# EAGLE design Servo_LED (EAGLE 9.5.2)
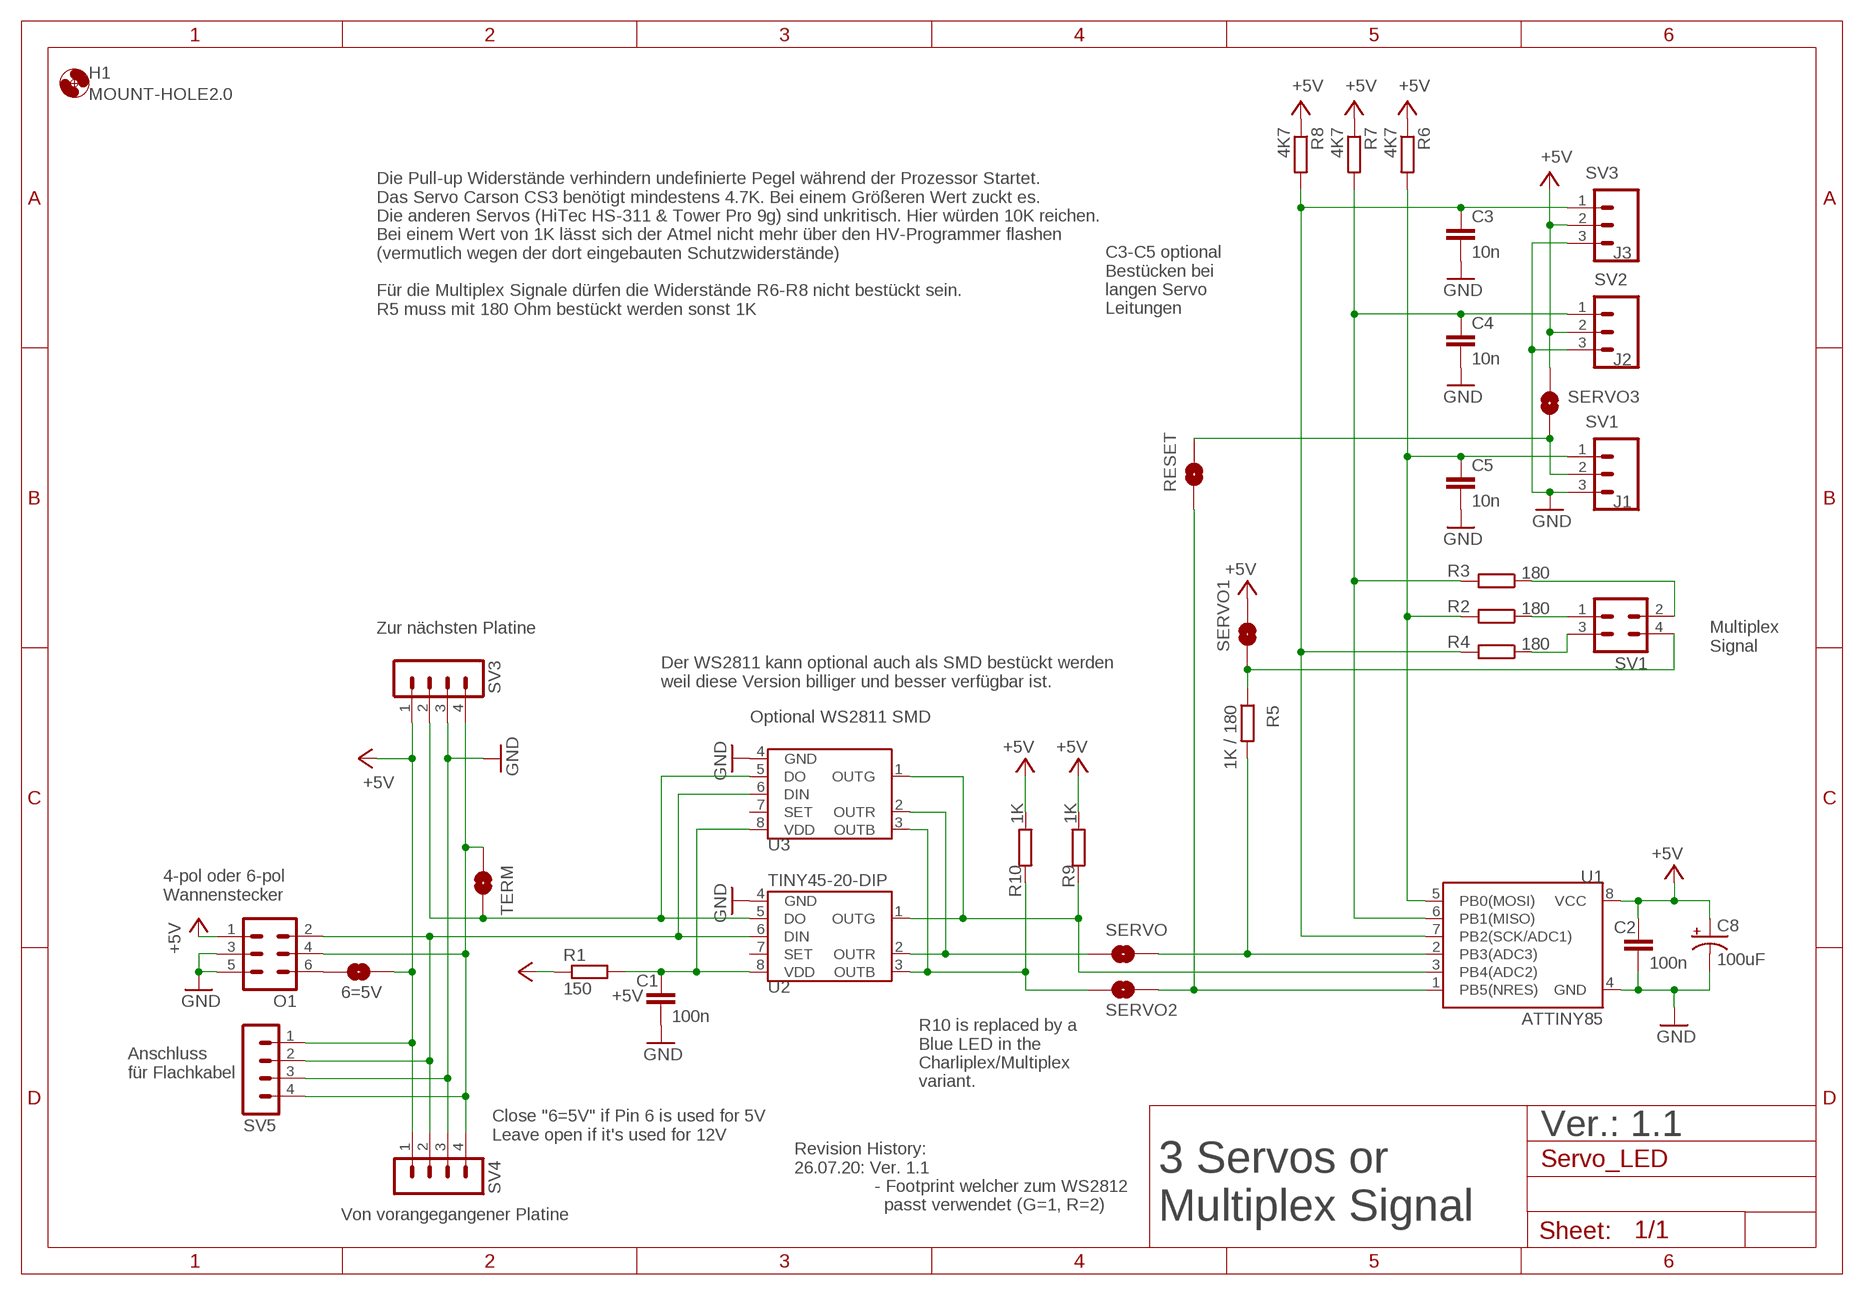
[diagram p0: schematic, sheet 1]

## Parts
6=5V  SOLDERJUMPERNO  [SJ_2S-NO]
C1  100n  C-EU025-024X044  [C025-024X044]
C2  100n  C-EU025-024X044  [C025-024X044]
C3  10n  C-EUC0805  [C0805]
C4  10n  C-EUC0805  [C0805]
C5  10n  C-EUC0805  [C0805]
C8  100uF  SPARKFUN-CAPACITORS_100UF-25V-20%(PTH)  [SPARKFUN-CAPACITORS_CPOL-RADIAL-100UF-25V]
H1  MOUNT-HOLE2.0  [2,0]
J1  SV1  M03PTH  [1X03]
J2  SV2  M03PTH  [1X03]
J3  SV3  M03PTH  [1X03]
O1  ML6  [ML6]
R1  150  RCL_R-EU_0207/2V  [RCL_0207/2V]
R2  180  RCL_R-EU_0207/2V  [RCL_0207/2V]
R3  180  RCL_R-EU_0207/2V  [RCL_0207/2V]
R4  180  RCL_R-EU_0207/2V  [RCL_0207/2V]
R5  1K / 180  RCL_R-EU_0207/2V  [RCL_0207/2V]
R6  4K7  RCL_R-EU_0207/2V  [RCL_0207/2V]
R7  4K7  RCL_R-EU_0207/2V  [RCL_0207/2V]
R8  4K7  RCL_R-EU_0207/2V  [RCL_0207/2V]
R9  1K  RCL_R-EU_0207/2V  [RCL_0207/2V]
R10  1K  RCL_R-EU_0207/2V  [RCL_0207/2V]
RESET  SOLDERJUMPERNO  [SJ_2S-NO]
SERVO  SOLDERJUMPERNO  [SJ_2S-NO]
SERVO1  SOLDERJUMPERNO  [SJ_2S-NO]
SERVO2  SOLDERJUMPERNO  [SJ_2S-NO]
SERVO3  SOLDERJUMPERNO  [SJ_2S-NO]
SV1  MA02-2MUX-SIGNAL  [MUX-SIGNAL]
SV3  MA04-1  [MA04-1]
SV4  MA04-1  [MA04-1]
SV5  MA04-1  [MA04-1]
TERM  SOLDERJUMPERNO  [SJ_2S-NO]
U1  ATTINY85  ATTINY45TINY85-20-DIP  [DIP08]
U2  TINY45-20-DIP  S3PO_MODUL_WS2811_SOUND_MP3-TF-16P_WS2811_AND_ATTINY_WS2811-ICTINY45-20-DIP  [S3PO_MODUL_WS2811_SOUND_MP3-TF-16P_WS2811_AND_ATTINY_WS2811_DIP08]
U3  WS2811 SOT-8  S3PO_MODUL_WS2811_SOUND_MP3-TF-16P_WS2811_AND_ATTINY_WS2811-ICSOP8  [SOP8]

## Nets
+5V: 6=5V.2 C2.1 C8.1(+) J2.2 J3.2 O1.1 R1.1 R6.1 R7.1 R8.1 R9.1 R10.1 SERVO1.2 SERVO3.2 SV3.1 SV4.1 SV5.1 U1.8(VCC)
GND: C1.2 C2.2 C3.2 C4.2 C5.2 C8.2(-) J1.3 J2.3 J3.3 O1.3 O1.5 SV3.3 SV4.3 SV5.3 U1.4(GND) U2.4(GND) U3.4(GND)
N$1: O1.2 SV4.2 SV5.2 U2.6(DIN) U3.6(DIN)
N$2: SV3.2 TERM.2 U2.5(DO) U3.5(DO)
N$3: O1.4 SV3.4 SV4.4 SV5.4 TERM.1
N$4: C1.1 R1.2 U2.8(VDD) U3.8(VDD)
N$5: R2.1 SV1.1
N$6: 6=5V.1 O1.6
N$7: R9.2 U1.3(PB4(ADC2)) U2.1(OUTG) U3.1(OUTG)
N$8: R5.2 SERVO.2 U1.2(PB3(ADC3))
N$9: C4.1 J2.1 R3.2 R7.2 U1.6(PB1(MISO))
N$10: R4.1 SV1.3
N$11: R3.1 SV1.2
N$12: R5.1 SERVO1.1 SV1.4
N$13: SERVO.1 U2.2(OUTR) U3.2(OUTR)
N$14: C3.1 J3.1 R4.2 R8.2 U1.7(PB2(SCK/ADC1))
N$15: RESET.1 SERVO2.2 U1.1(PB5(NRES))
N$16: C5.1 J1.1 R2.2 R6.2 U1.5(PB0(MOSI))
N$17: J1.2 RESET.2 SERVO3.1
N$18: R10.2 SERVO2.1 U2.3(OUTB) U3.3(OUTB)
Unconnected: U2.7(SET) U3.7(SET)

## Notes on the sheet
- Die Pull-up Widerstände verhindern undefinierte Pegel während der Prozessor Startet. 
  Das Servo Carson CS3 benötigt mindestens 4.7K. Bei einem Größeren Wert zuckt es. 
  Die anderen Servos (HiTec HS-311 & Tower Pro 9g) sind unkritisch. Hier würden 10K reichen. 
  Bei einem Wert von 1K lässt sich der Atmel nicht mehr über den HV-Programmer flashen 
  (vermutlich wegen der dort eingebauten Schutzwiderstände) 
  
  Für die Multiplex Signale dürfen die Widerstände R6-R8 nicht bestückt sein.
  R5 muss mit 180 Ohm bestückt werden sonst 1K
- C3-C5 optional 
  Bestücken bei
  langen Servo 
  Leitungen
- Zur nächsten Platine
- Multiplex
  Signal
- Der WS2811 kann optional auch als SMD bestückt werden
  weil diese Version billiger und besser verfügbar ist.
- Optional WS2811 SMD
- 4-pol oder 6-pol 
  Wannenstecker
- Anschluss
  für Flachkabel
- R10 is replaced by a 
  Blue LED in the 
  Charliplex/Multiplex 
  variant.
- Ver.: 1.1
- Close "6=5V" if Pin 6 is used for 5V
  Leave open if it's used for 12V
- Von vorangegangener Platine
- 3 Servos or 
  Multiplex Signal
- Revision History:
  26.07.20: Ver. 1.1
                  - Footprint welcher zum WS2812 
                    passt verwendet (G=1, R=2)

## Library data of the parts
6=5V RESET SERVO SERVO1-SERVO3 TERM = SparkFun-Retired:SOLDERJUMPER: Solder Jumper Standard SMD solder jumper. Used to automate production. Two varients : Normally Open and Normally Closed are the same, but have different paste layers. NC will have a large amount of paste and should jumper during reflow.
C1-C5 = rcl:C-EU: CAPACITOR, European symbol; SPICEPREFIX: C
C8 = Sound_MP3-TF-16P_and_WS2811:SPARKFUN-CAPACITORS_100UF-25V-20%(PTH): CAP-08439; PROD_ID: CAP-08439
H1 = holes:MOUNT-HOLE: MOUNTING HOLE with drill center marker
J1-J3 = SparkFun-Connectors:M03: Header 3 Standard 3-pin 0.1" header. Use with straight break away headers (SKU : PRT-00116), right angle break away headers (PRT-00553), swiss pins (PRT-00743), machine pins (PRT-00117), and female headers (PRT-00115). Molex polarized connector foot print use with SKU : PRT-08232 with associated crimp pins and housings.
O1 = con-harting-ml:ML6: HARTING; OC_FARNELL: unknown; OC_NEWARK: unknown
R1-R10 = Sound_MP3-TF-16P_and_WS2811:RCL_R-EU_: RESISTOR, European symbol; SPICEPREFIX: R
SV1 = con-lstb:MA02-2: PIN HEADER
SV3-SV5 = con-lstb:MA04-1: PIN HEADER
U1 = SparkFun-DigitalIC:ATTINY45: Atmel 8-pin 2/4/8kB flash uC; PROD_ID: IC-09445; VALUE: TINY85-20-DIP
U2 = S3PO_Modul_WS2811:S3PO_MODUL_WS2811_SOUND_MP3-TF-16P_WS2811_AND_ATTINY_WS2811-IC: Die Pin Nummern für R und G sind getauscht damit sie gleich angesteuert werden wie die WS2812. Der Daten Strom der WS2811 ist RGB, Beim WS2812 ist es aber GRB.; PROD_ID: IC-09439
U3 = S3PO_Modul_WS2811:S3PO_MODUL_WS2811_SOUND_MP3-TF-16P_WS2811_AND_ATTINY_WS2811-IC: Die Pin Nummern für R und G sind getauscht damit sie gleich angesteuert werden wie die WS2812. Der Daten Strom der WS2811 ist RGB, Beim WS2812 ist es aber GRB.

## Board
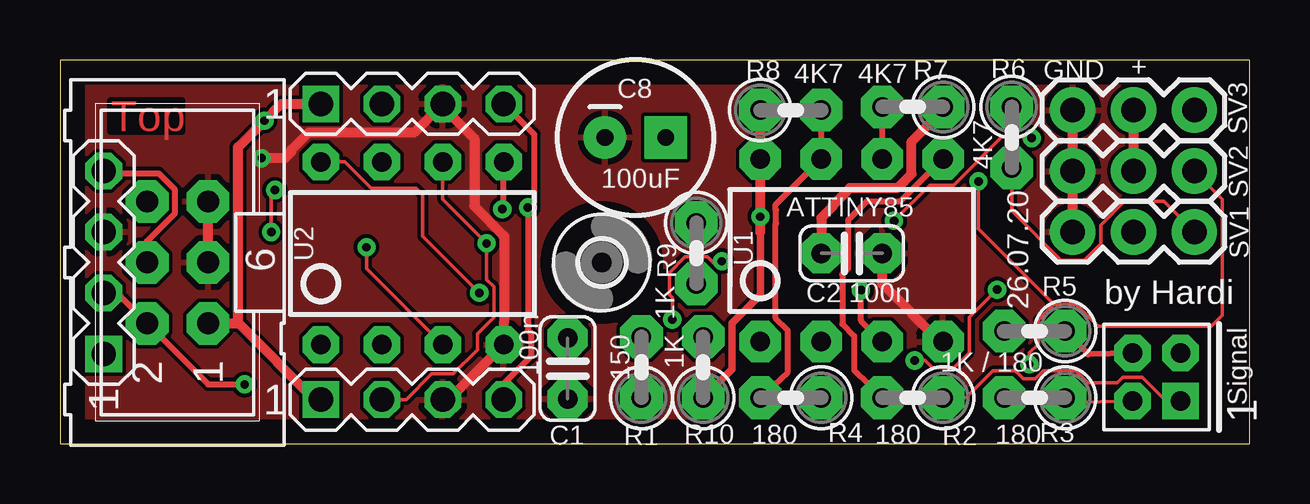
[diagram p1: board, top side]
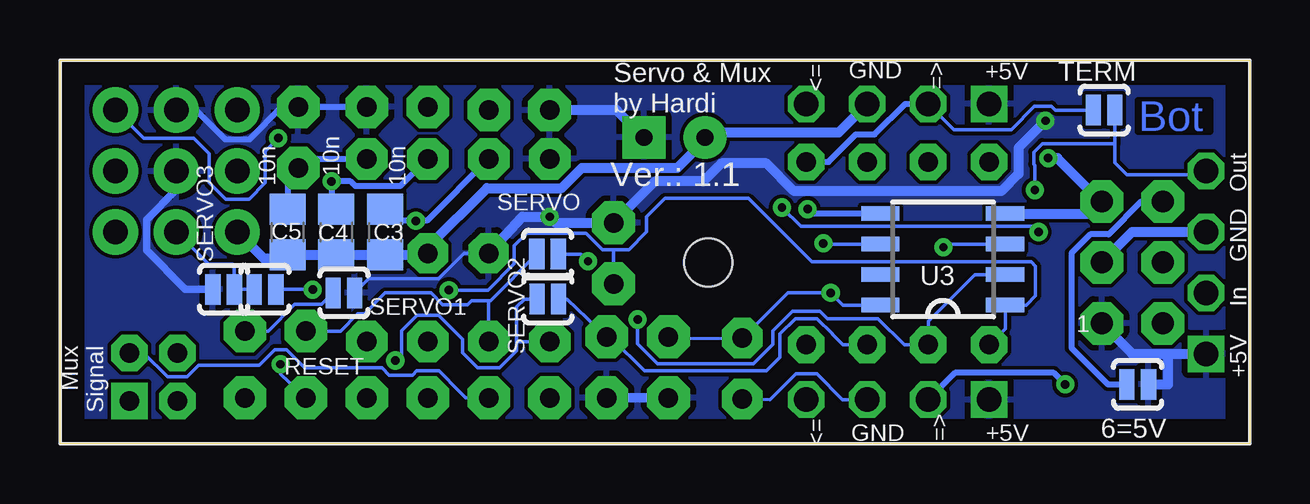
[diagram p2: board, bottom side, seen from below]

Size 49.6 x 15.99 mm. Coordinates in mm from the lower left corner, seen from the top.
Outline: 0,0 49.6,0 49.6,15.99 0,15.99 0,0
Copper layers (1*16): Top 0.035mm / dielectric 1.5mm / Bottom 0.035mm
Design rules "default": minimum track width 6mil, minimum drill 0.35mm, track to track 6mil, track to pad 6mil, pad to pad 6mil, via to via 6mil, smd to smd 6mil, copper to edge 40mil, drill to drill 6mil, minimum pad ring 10mil, minimum via ring 8mil, stop-mask expansion 4mil, vias tented up to drill 0mil, thermal gap 10mil

### Footprints (pad centres in the part's own frame; a part is rotated, then mirrored left to right if it is on the bottom)
SJ_2S-NO = smd 0.635 x 1.27: 1 -0.45,0; 2 0.45,0
C025-024X044 = drill 0.813 pad 1.676 octagon: 1 -1.27,0; 2 1.27,0
C0805 = smd 1.3 x 1.5: 1 -0.95,0; 2 0.95,0
SPARKFUN-CAPACITORS_CPOL-RADIAL-100UF-25V = drill 0.7 pad 1.778 square: 1 1.27,0 | drill 0.7 pad 1.778: 2 -1.27,0
2,0 = hole 2: 0,0
1X03 = drill 1.016 pad 1.88: 1 0,0; 2 2.54,0; 3 5.08,0
ML6 = drill 0.914 pad 1.778 octagon: 1 -2.54,-1.27; 2 -2.54,1.27; 3 0,-1.27; 4 0,1.27; 5 2.54,-1.27; 6 2.54,1.27
RCL_0207/2V = drill 0.813 pad 1.778 octagon: 1 -1.27,0; 2 1.27,0
MUX-SIGNAL = drill 0.8 pad 1.524 square: 1 -1,-1 | drill 0.8 pad 1.524 octagon: 2 -1,1; 3 1,-1; 4 1,1
MA04-1 = drill 1.016 pad 1.524 square: 1 -3.81,0 | drill 1.016 pad 1.524 octagon: 2 -1.27,0; 3 1.27,0; 4 3.81,0
DIP08 = drill 0.813 pad 1.727 octagon: 1 -3.81,-3.81; 2 -1.27,-3.81; 3 1.27,-3.81; 4 3.81,-3.81; 5 3.81,3.81; 6 1.27,3.81; 7 -1.27,3.81; 8 -3.81,3.81
S3PO_MODUL_WS2811_SOUND_MP3-TF-16P_WS2811_AND_ATTINY_WS2811_DIP08 = drill 0.813 pad 1.524 octagon: 1 -3.81,-3.81; 2 -1.27,-3.81; 3 1.27,-3.81; 4 3.81,-3.81; 5 3.81,3.81; 6 1.27,3.81; 7 -1.27,3.81; 8 -3.81,3.81
SOP8 = smd 0.6 x 1.6: 1 -1.905,-2.6; 2 -0.635,-2.6; 3 0.635,-2.6; 4 1.905,-2.6; 5 1.905,2.6; 6 0.635,2.6; 7 -0.635,2.6; 8 -1.905,2.6

### Placement (x,y rotation side)
6=5V  4.68,2.48 0 bottom
C1  21.16,3.14 270 top
C2  33,7.94 0 top
C3  36.05,8.83 270 bottom
C4  38.08,8.83 270 bottom
C5  40.11,8.83 270 bottom
C8  23.98,12.76 0 top
H1  22.59,7.55 0 top
J1  47.29,8.83 180 top
J2  47.29,11.37 180 top
J3  47.29,13.91 180 top
O1  4.9,7.55 90 top
R1  24.24,3.19 90 top
R2  35.54,1.92 180 top
R3  40.62,1.92 180 top
R4  30.46,1.92 180 top
R5  40.62,4.7 180 top
R6  39.67,12.76 270 top
R7  35.54,14.03 180 top
R8  30.46,13.91 0 top
R9  26.52,7.94 270 top
R10  26.81,3.19 90 top
RESET  41.05,6.44 180 bottom
SERVO  29.28,7.9 180 bottom
SERVO1  37.76,6.28 0 bottom
SERVO2  29.27,6.03 180 bottom
SERVO3  42.78,6.44 180 bottom
SV1  45.71,2.78 90 top
SV3  14.68,14.16 0 top
SV4  14.68,1.84 0 top
SV5  1.82,7.55 90 top
TERM  6.08,13.91 180 bottom
U1  33,8.06 0 top
U2  14.68,7.94 0 top
U3  12.8,7.68 90 bottom

### Tracks (layer width: path | path; a pad name or v marks a point on that pad's centre or on a via)
+5V  (via drill 0.35)
  Top 0.305: R10.1 26.84,1.95 28,3.11 28,5.01 29.19,6.2 29.19,8.83
  Top 0.406: O1.1 7.44,5.01 | 29.19,8.83 v29.19,9.46 U1.8 R8.1 | C2.1 31.73,9.41 32.21,9.9 32.21,9.94 32.93,10.65 34.91,10.65 35.49,11.24 35.49,12.58 36.81,13.91 R7.1 | J3.2 J2.2 | 7.44,5.01 7.42,5.04 7.42,12.36 v8.52,13.46 9.22,14.16 SV3.1 | 7.44,5.01 10.62,1.84 SV4.1
  Bottom 0.152: C2.1 32.76,7.94 33.83,6.87 36.73,6.87 SERVO1.2
  Bottom 0.254: J3.2 43.93,13.91 42.71,12.69 41.7,12.69 40.36,14.03 R6.1 R7.1
  Bottom 0.305: J2.2 44.75,10.59 45.99,9.34 45.99,8.06 44.37,6.44 SERVO3.2
  Bottom 0.406: O1.1 4.9,3.75 3.41,3.75 | C8.1 26.4,13.91 R8.1 | C2.1 30.33,9.46 v29.19,9.46 28.94,9.21 R9.1 24.8,10.93 22.78,10.93 22.03,11.68 20.15,11.68 19,10.53 10.37,10.53 9.65,11.24 9.65,12.33 v8.52,13.46 | R1.1 26.75,1.9 R10.1 | 3.41,3.75 SV5.1 | 6=5V.2 3.41,2.48 3.41,3.75
  pour Bottom: 0.71,15.49 49.13,15.49 49.13,0.58 0.71,0.58
GND  (via drill 0.35)
  Top 0.406: O1.3 O1.5 | U1.4 36.68,4.25 34.27,6.67 C2.2 | J1.3 J2.3 J3.3 | SV4.3 16.21,1.84 U2.4 18.49,5.06 18.52,5.08 18.52,8.65 17.27,9.9 17.27,12.71 15.95,14.03 SV3.3 14.76,12.96 10.37,12.96 9.65,12.25 9.65,12.18 9.38,11.9 v8.4,11.9
  Bottom 0.152: SV4.3 16.98,1.84 18.05,2.91 18.93,2.91 20,1.84 C1.2
  Bottom 0.406: 6.19,10.07 O1.5 | O1.3 4.9,8.83 SV5.3 | SV3.3 17.15,12.97 22.51,12.97 C8.2 22.71,12.64 23.86,11.49 27.85,11.49 28.69,10.65 31.81,10.65 34.27,8.19 C2.2 34.33,7.88 C3.2 C4.2 C5.2 40.26,7.73 41.11,7.73 J1.3 | v8.4,11.9 8.02,11.9 6.19,10.07 | U3.4 6.68,9.59 6.19,10.07
  pour Top: 0.71,15.49 49.13,15.49 49.13,0.58 0.71,0.58
N$1  (via drill 0.35)
  Top 0.152: SV4.2 14.43,1.84 15.49,2.91 16.39,2.91 17.4,3.91 17.4,4.58 18.09,5.26 18.09,6.54 17.78,6.84 v17.78,8.35 15.95,10.18 U2.6
  Top 0.254: v7.7,2.48 6.17,2.48 O1.2 2.36,6.28 SV5.2
  Bottom 0.152: v17.78,8.35 17.75,8.32 U3.6
  Bottom 0.254: SV4.2 12.29,2.96 8.18,2.96 v7.7,2.48
N$2  (via drill 0.35)
  Top 0.254: v18.44,9.78 18.49,9.83 U2.5
  Bottom 0.152: SV3.2 12.34,13.09 9.95,13.09 8.98,14.07 8.27,14.07 8.11,13.91 TERM.2
  Bottom 0.254: SV3.2 14.37,14.16 15.64,12.89 16.43,12.89 17.57,11.75 U2.5 | U3.5 18.25,9.59 v18.44,9.78
N$3  (via drill 0.35)
  Top 0.152: v8.97,10.58 8.81,10.42 v8.81,8.83
  Top 0.254: O1.4 3.63,8.44 4.8,9.61 4.8,10.58 4.12,11.26 1.92,11.26 SV5.4 | SV4.4 18.49,2.51 19.63,3.65 19.63,4.6 19.51,4.73 v19.51,9.84 19.76,10.1 19.76,12.89 SV3.4
  Bottom 0.152: SV5.4 1.98,11.21 5.13,11.21 5.63,11.71 5.63,12.51 | v8.97,10.58 8.97,11.61 9.01,11.65 9.01,12.15 8.66,12.51 5.63,12.51 | v19.51,9.84 18.72,9.06 9.04,9.06 v8.81,8.83 | TERM.1 5.63,12.51
N$4  (via drill 0.35)
  Top 0.152: U2.8 11.87,11.75 12.96,10.65 14.84,10.65 15.12,10.37 15.12,8.64 v17.48,6.28
  Bottom 0.152: R1.2 24.18,4.38 C1.1 19.25,6.28 v17.48,6.28 16.97,5.78 U3.8
N$5
  Top 0.152: SV1.1 46.11,1.78 45.12,2.77 44.3,2.77 44.07,2.54 42.85,2.54 42.35,3.03 40.98,3.03 40.66,2.71 40.15,2.71 39.87,3 39.85,3 39.81,3.03 38.89,3.03 37.77,1.92 R2.1
N$6
  Bottom 0.254: 6=5V.1 5.92,2.48 7.44,4 7.44,7.94 6.66,8.72 5.89,8.72 4.52,10.1 O1.6
N$7  (via drill 0.35)
  Top 0.254: U1.3 33.39,5.13 v33.39,6.4
  Bottom 0.152: v33.39,6.4 31.76,6.4 30.66,7.49 30.66,8.24 30.13,8.77 27.67,8.77 26.99,8.09 26.52,8.09 | 26.52,8.09 25.89,8.09 25.15,8.83 25.15,9.46 24.39,10.22 20.91,10.22 18.26,7.58 9.11,7.58 8.94,7.4 8.94,6.16 9.32,5.78 U3.1 10.2,4.8 U2.1 | R9.2 26.52,8.09
N$8
  Bottom 0.152: R5.2 37.91,4.7 37.19,5.42 36.9,5.42 36.04,6.28 34.14,6.28 33.64,5.79 32.62,5.79 32.45,5.97 31.78,5.97 | U1.2 31.73,5.92 31.78,5.97 | SERVO.2 31.66,5.97 31.78,5.97
N$9  (via drill 0.35)
  Top 0.152: 41.43,5.81 42.35,5.81 43.28,4.89 47.99,4.89 48.46,5.36 48.46,10.2 J2.1 | 41.43,5.81 40.77,5.16 40.77,4.15 40.41,3.78 v40.41,3.31 | 41.43,5.81 38.28,8.96 v38.28,10.93
  Top 0.254: U1.6 R7.2
  Bottom 0.152: v40.41,3.31 40.41,2.89 R3.2
  Bottom 0.254: C4.1 38.28,9.98 v38.28,10.93 37.49,10.93 37.28,10.73 35.41,10.73 U1.6
N$10
  Bottom 0.152: R4.1 32.69,1.92 32.94,2.16 33.81,3.03 34.73,3.03 34.9,2.86 35.87,2.86 36.17,3.16 39.4,3.16 40.15,3.92 40.66,3.92 41.3,3.27 43.81,3.27 44.3,2.79 45.12,2.79 46.11,3.78 SV1.3
N$11
  Top 0.152: SV1.2 42,1.73 R3.1
N$12
  Top 0.254: SV1.4 42.86,3.73 R5.1
  Bottom 0.152: SERVO1.1 38.68,5.81 39.81,5.81 40.93,4.7 R5.1
N$13  (via drill 0.35)
  Top 0.152: v25.52,5.18 25.52,6.09 25.41,6.2 25.41,7.13 26.06,7.78 26.99,7.78 27.22,7.55 27.54,7.55 v27.59,7.61
  Bottom 0.152: v25.52,5.18 25.52,4.85 25.53,4.84 25.53,4.17 24.7,3.34 20.69,3.34 19.89,4.14 19.89,4.7 19.07,5.52 17.91,5.52 17.61,5.22 15.5,5.22 14.41,4.13 U2.2 13.41,5.1 11.47,7.05 U3.2 | v27.59,7.61 27.88,7.9 SERVO.1
N$14  (via drill 0.35)
  Top 0.152: v34.76,9.29 36.26,10.78 37.26,10.78 39.27,12.79 40.45,12.79 v40.5,12.73
  Top 0.254: R4.2 30.33,2.98 30.33,4.73 29.83,5.23 29.83,9.17 29.85,9.19 29.85,9.73 29.83,9.76 29.83,9.97 U1.7 R8.2
  Bottom 0.152: v34.76,9.29 34.45,9.29 34.43,9.3 | J3.1 46.12,12.73 44.03,12.73 43.38,12.08 43.38,10.88 42.69,10.2 41.73,10.2 41.04,10.88 41.04,12.2 v40.5,12.73
  Bottom 0.254: U1.7 34.3,9.3 34.43,9.3 36.02,9.3 36.04,9.28 C3.1
N$15  (via drill 0.35)
  Top 0.152: v39.06,6.42 37.9,5.26 37.9,3.8 37.26,3.16 36.36,3.16 36.05,3.47 v35.62,3.47
  Bottom 0.152: RESET.1 39.08,6.44 v39.06,6.42 | v35.62,3.47 35.36,3.73 35.36,4.7 34.72,5.34 33.82,5.34 32.82,4.35 32.82,3.8 32.18,3.16 31.28,3.16 30.56,3.88 30.56,4.25 | SERVO2.2 30.23,6.03 30.56,5.7 30.56,4.25 | U1.1 30.56,4.25
N$16
  Top 0.152: R6.2 39.67,9.71 41.73,7.66 42.69,7.66 43.38,8.34 43.38,9.11 44.37,10.1 46.02,10.1 J1.1
  Top 0.254: R2.2 33.1,3.07 33.1,4.5 32.61,4.99 32.61,7.05 32.85,7.29 32.85,9.31 33.64,10.1 35.03,10.1 U1.5
  Bottom 0.254: U1.5 39.29,11.87 R6.2 40.11,11.05 C5.1
N$17
  Bottom 0.152: RESET.2 SERVO3.1 42.33,7.41 42.4,7.48 43.4,7.48 J1.2
N$18  (via drill 0.35)
  Top 0.152: U2.3 12.78,7.3 v12.78,8.19
  Bottom 0.152: U2.3 16.97,4.13 17.4,4.56 17.4,4.58 18.04,5.22 18.94,5.22 19.58,4.58 19.58,3.6 20.16,3.03 25.24,3.03 26.59,4.38 R10.2 28.46,6.03 SERVO2.1 | v12.78,8.19 12.65,8.32 U3.3

### Text on the board
Top: Top
Bottom: Bot
tPlace: Signal
bPlace: => | <= | +5V | GND | Out | GND | In | +5V | 1 | Mux / Signal | <= | +5V | => | GND
tNames: GND | + | by Hardi | 26.07.20
bNames: Servo & Mux | by Hardi | Ver.: 1.1